# Altium project PowerConvertor.PrjPcb
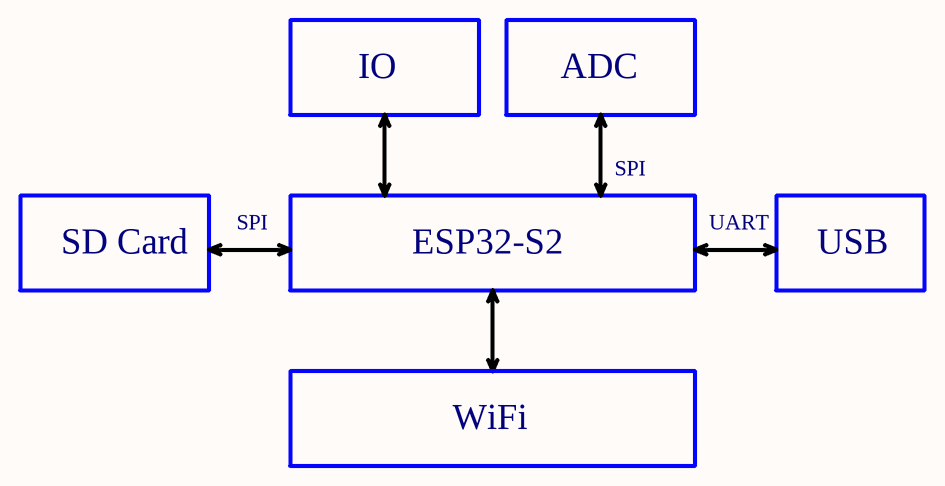
[diagram p0: 00_Block_Diagram.SchDoc]
3 sheets, 1 parts. Net scope: global (net labels, ports and power ports of the same name join across sheets).
Board file: PowerConvertorV1.PcbDoc
Sheets:
  00_Block_Diagram.SchDoc
  01_Power_Diagram.SchDoc
  02_Power_Transform_220_24V.SchDoc

## Sheet 00_Block_Diagram.SchDoc: Block Diagram
size A4; DrawnBy: Micls; SheetNumber: 1; SheetTotal: 2

### Notes on the sheet
- IO
- ADC
- SPI
- UART
- SD Card
- ESP32-S2
- USB
- WiFi
- APPROVALS
- DATE
- PROJECT
- BOM:
- REFERENCE DOCUMENTS
- TITLE
- PROJECT REVISION
- DOCUMENT REVISION
- ASSY DWG:
- FAB DWG:
- PCB DWG:
- SIZE:
- Drawn by:
- A4
- FILE NAME:
- Checked by:
- Date:
- REV
- SHEET
- Time:
- OF

## Sheet 01_Power_Diagram.SchDoc
size A4; SheetNumber: 2; SheetTotal: 2
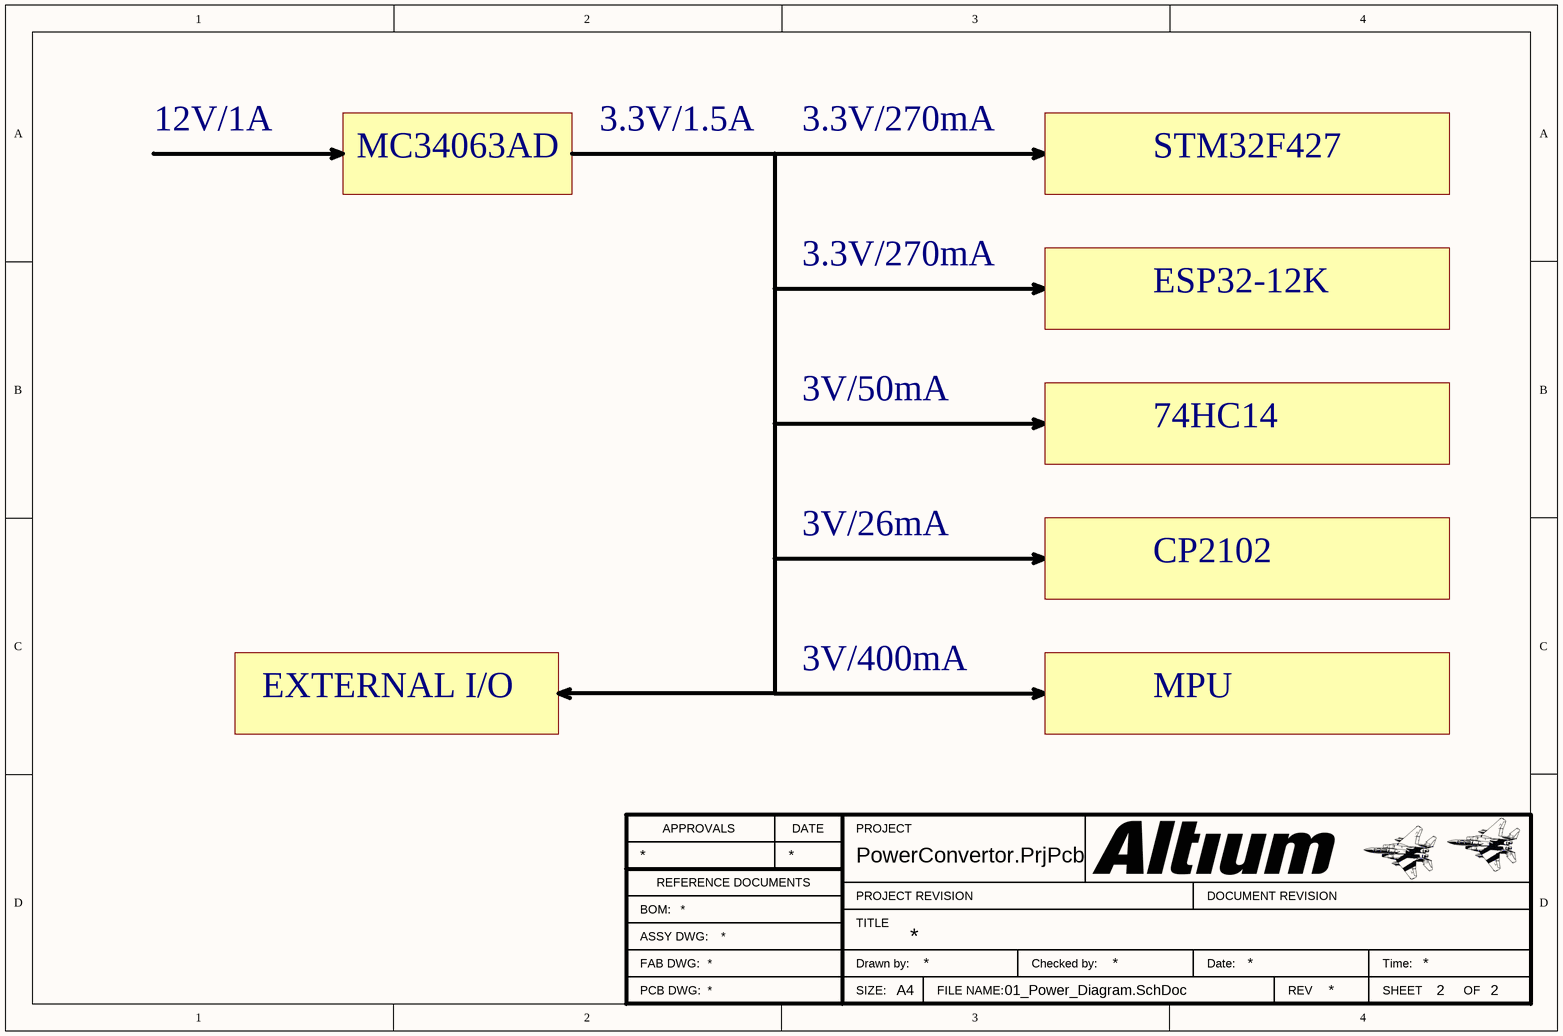
[diagram p1: 01_Power_Diagram.SchDoc]

### Notes on the sheet
- 12V/1A
- MC34063AD
- 3.3V/1.5A
- 3.3V/270mA
- STM32F427
- ESP32-12K
- 3V/50mA
- 74HC14
- 3V/26mA
- CP2102
- EXTERNAL I/O
- 3V/400mA
- MPU
- APPROVALS
- DATE
- PROJECT
- BOM:
- REFERENCE DOCUMENTS
- TITLE
- PROJECT REVISION
- DOCUMENT REVISION
- ASSY DWG:
- FAB DWG:
- PCB DWG:
- SIZE:
- Drawn by:
- A4
- FILE NAME:
- Checked by:
- Date:
- REV
- SHEET
- Time:
- OF

## Sheet 02_Power_Transform_220_24V.SchDoc
size A4; SheetNumber: 3; SheetTotal: 3
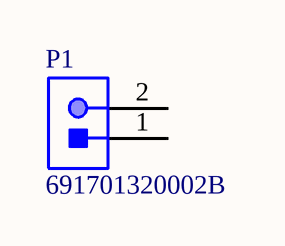
[diagram p2: 02_Power_Transform_220_24V.SchDoc]

### Parts
P1  691701320002B  [691701320002B]

### Nets

Not connected (* = marked no-connect by the designer): P1 1 2

### Notes on the sheet
- APPROVALS
- DATE
- PROJECT
- BOM:
- REFERENCE DOCUMENTS
- TITLE
- PROJECT REVISION
- DOCUMENT REVISION
- ASSY DWG:
- FAB DWG:
- PCB DWG:
- SIZE:
- Drawn by:
- A4
- FILE NAME:
- Checked by:
- Date:
- REV
- SHEET
- Time:
- OF

### Library data of the parts
P1 = 691701320002B: WR-TBL Serie 7013 Vertical PCB Header THR Type with Flanges, Pluggable, pitch 3.81mm, 2p; Compliance: RoHS; Modularity: No; Pin Number: 2; Rated Current [UL]: 10A; Working Voltage [UL]: 300VAC; ComponentLink1Description: Manufacturer; ComponentLink1URL: http://www.we-online.de; ComponentLink2URL: https://katalog.we-online.de/em/datasheet/691701320002B.pdf; ComponentLink2Description: Datasheet; Mounting Technology: THR; Part Number: 691701320002B; Packaging: Box; Operating Temperature: -40 to +105degC; PCB/Cable/Panel: PCB; Pitch: 3.81mm; Published Date: October 2019; Type: Vertical; Publisher: Wurth Elektronik; Application: Pluggable